# EasyEDA schematic SCH_RUN-Reset.json

## Sheets
1 SW
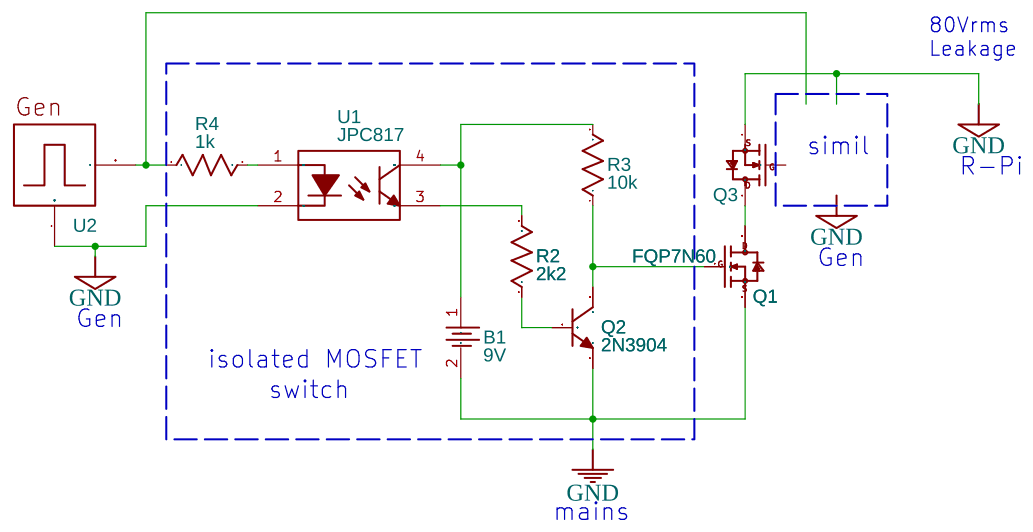
[diagram p0: SW]
2 Diff
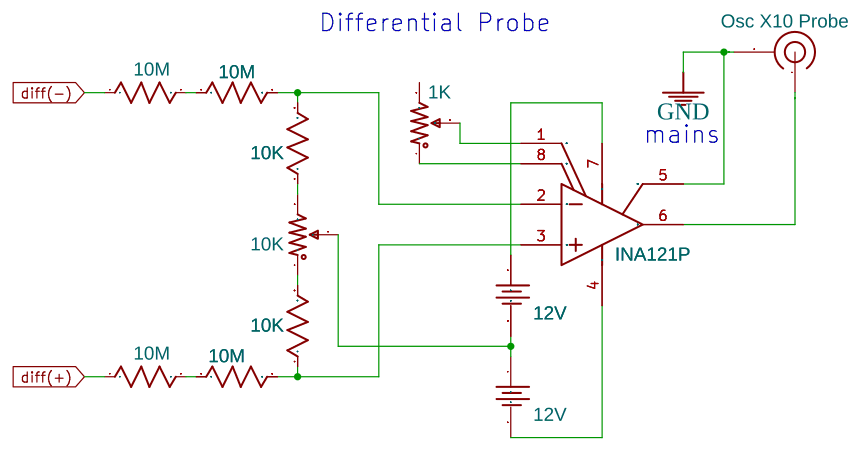
[diagram p1: Diff]
3 Sim
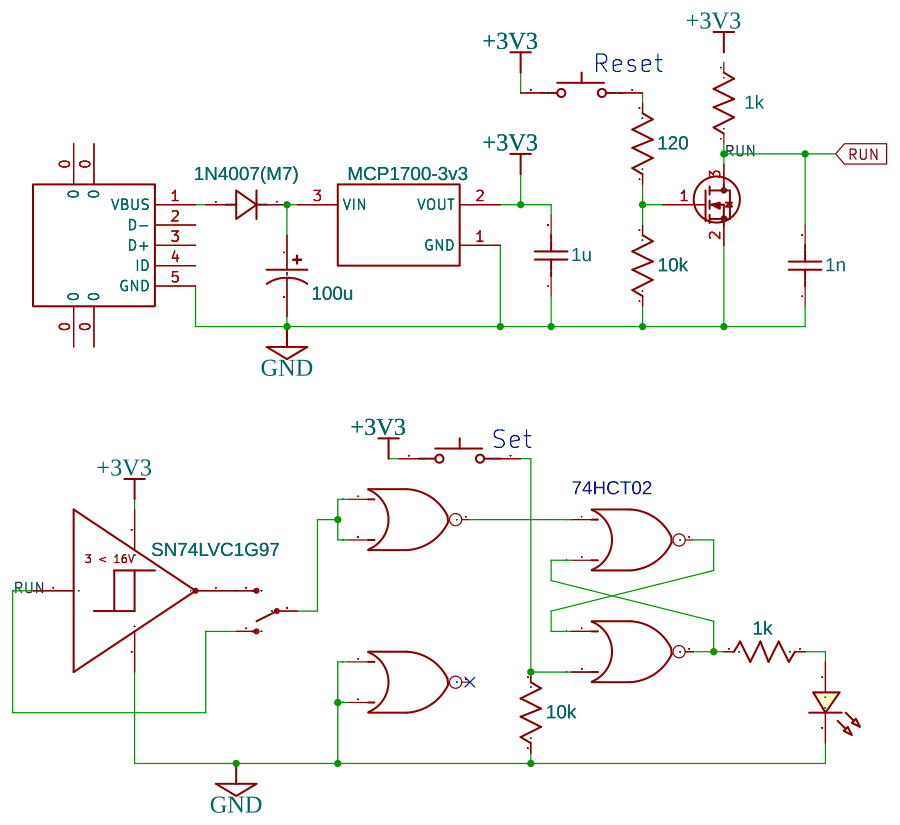
[diagram p2: Sim]
4 Reset
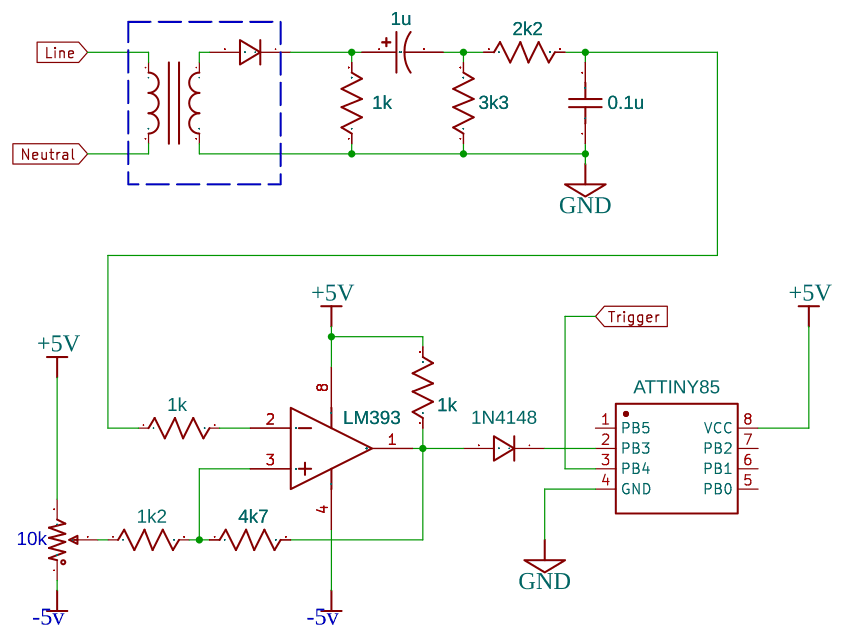
[diagram p3: Reset]

## Parts
sheet Diff
B2  12V  [BAT-SMD_CR1220-2]
B3  12V  [BAT-SMD_CR1220-2]
R1  10M  [R0603]
R5  10M  [R0603]
R6  10M  [R0603]
R7  10M  [R0603]
R8  10K  [R0603]
R9  10K  [R0603]
RP1  1K  [RES-ADJ-TH_3386P]
RP2  10K  [RES-ADJ-TH_3386P]
U3  Osc X10 Probe  [COAX PCB]
U4  INA121P  [PDIP-8_L9.5-W6.4-P2.54-LS7.6-BL]
sheet Reset
C3  1u  [CASE-A_3216]
C4  0.1u  [C0603]
D1  1N4007W  [SOD-123_L2.8-W1.8-LS3.7-RD]
D2  1N4148  [SOD-123_L2.8-W1.8-LS3.7-RD]
R15  1k  [R0603]
R16  3k3  [R0603]
R17  2k2  [R0603]
R18  1k2  [R0603]
R19  4k7  [R0603]
R20  1k  [R0603]
R21  1k  [R0603]
RP3  R_3386P_US  [RES-ADJ-TH_3386P]
U14  TRANS  [TRANSFORMER]
U15  LM393  [SOIC-8_L4.9-W3.9-P1.27-LS6.0-BL]  (section 1)
U16  ATTINY85  [SOIC-8_L5.3-W5.3-P1.27-LS8.0-BL]
sheet Sim
C1  100u  [CASE-A_3216]
C2  1u  [C0603]
C5  1n  [C0603]
LED1  LED-0603_R  [LED0603_RED]
R10  10k  [R0603]
R11  120  [R0603]
R12  1k  [R0603]
R13  1k  [R0603]
R14  10k  [R0603]
S1  SWITCH-SPDT Panelmount  [STDP GABBAGABI]
SN74LVC1G97  NO  [SCHMITT INVERTER]
U5  1N4007(M7)  [SMA_L4.3-W2.7-LS5.1-RD]
U6  MCP1700-3v3  [SOT-23-3_L2.9-W1.3-P1.90-LS2.4-BR]
U7  NO  [2N7002]
U8  BUTTON2  [SW-SMD_L6.0-W3.5-LS8.0-1]
U9  NO
U10  NO
U11  NO
U12  NO
U13  BUTTON2  [SW-SMD_L6.0-W3.5-LS8.0-1]
USB1  micro 5P_C77238  [MICRO-USB_MICRO-USB-17]
sheet SW
B1  9V  [BAT-SMD_CR1220-2]
Q1  FQP7N60  [SEEED-SOT-23]
Q2  2N3904  [TO-92-3_L5.1-W4.1-P1.27-L]
Q3  NO  [SEEED-SOT-23]
R2  2k2  [R0603]
R3  10k  [R0603]
R4  1k  [R0603]
U1  JPC817  [DIP-4_L6.5-W4.6-P2.54-LS7.6-BL]
U2  NO  [FUNCTION GENERATOR KK]

## Library data of the parts
B1-B3 = CR1220-2: Supplier: LCSC; Manufacturer: Q&J; image: //image.lceda.cn/szlcsc/C70381.jpg; Supplier Part: C70381
R1-R21 = R_0603_US: Contributor: LCEDA_Lib
RP1 RP3 = R_3386P_US: Supplier: LCSC; Contributor: LCEDA_Lib; value(Ω): 10K
RP2 = R_3386P_US: Supplier: LCSC; Contributor: LCEDA_Lib
U3 = coax: Contributor: nomouelle
U4 = INA121P: Contributor: LCSC; Supplier: LCSC; Supplier Part: C1347772; Manufacturer: TI(德州仪器); JLCPCB Part Class: Extended Part; link: https://lcsc.com/eda_search?q=C1347772&%26type=1&ref=editor
C1 C3 = C_Tan_SMD_A_US: Contributor: LCEDA_Lib
C2 C4 C5 = C_0603_US: Contributor: LCEDA_Lib
D1 D2 = 1N4007W: Supplier: LCSC; Supplier Part: C328592; Manufacturer: BLUE ROCKET; Contributor: LCEDA_Lib
U14 = TRANS: Contributor: 4ENGINEERS
U15 = LM393A-SR: subpart_no: 1; Supplier: LCSC; Supplier Part: C2690180; Manufacturer: 3PEAK; link: https://lcsc.com/eda_search?q=C2690180&%26type=1&ref=editor
U16 = ATTINY85V-10SU: Contributor: LCSC; Supplier: LCSC; Supplier Part: C152192; Manufacturer: MICROCHIP(美国微芯); JLCPCB Part Class: Extended Part; link: https://lcsc.com/eda_search?q=C152192&%26type=1&ref=editor
LED1 = LED-0603_R: Manufacturer: EVERLIGHT(台湾亿光); Manufacturer Part: 19-217/R6C-AL1M2VY/3T; Supplier Part: C72044; Supplier: LCSC; Contributor: LCEDA_01
S1 = SWITCH-SPDT Panelmount: Contributor: gabbagabi
SN74LVC1G97 = Schmitt Inverter: Manufacturer: ROHM Semiconductor; Manufacturer Part: BU4S584G2-TR; Supplier: Mouser; link: https://www.mouser.tw/ProductDetail/ROHM-Semiconductor/BU4S584G2-TR?qs=%2Fha2pyFadujrli%252BPTslmoLvNkPYOHJBJfyhxRCxfzx0KWZPwSXGCuA%3D%3D; Contributor: hunglaa; Rated Power: 0.67; Rated Voltage: 16
U5 = 1N4007(M7): Contributor: lcsc; Supplier: LCSC; Supplier Part: C2988638; Manufacturer: UMW(广东友台半导体); JLCPCB Part Class: Extended Part; link: https://lcsc.com/eda_search?q=C2988638&%26type=1&ref=editor
U6 = MCP1700T-3002E/TT: Supplier: LCSC; Manufacturer: MICROCHIP(美国微芯); Supplier Part: C62244; JLCPCB Part Class: Extended Part; link: https://lcsc.com/eda_search?q=C62244&%26type=1&ref=editor
U7 = 2N7002-: Contributor: DrSavitaGaur; Supplier: SeeedStudio
U8 U13 = BUTTON2: Contributor: LCSC; Supplier: LCSC; Supplier Part: C9900005988; Manufacturer: null; JLCPCB Part Class: Extended Part; link: https://lcsc.com/eda_search?q=C9900005988&%26type=1&ref=editor
U9-U12 = NorGate
USB1 = micro 5P_C77238: Contributor: 立创EDA官方封装库; Supplier: LCSC; Supplier Part: C77238; Manufacturer: 精拓金; Manufacturer Part: 920-D62A2021S10107; JLCPCB Part Class: Extended Part; link: https://lcsc.com/eda_search?q=C77238&%26type=1&ref=editor
Q1 Q3 = MOSFET-N: sourceId: lTtPN9uQc
Q2 = 2N3904: Supplier: LCSC; Manufacturer: ST(先科); Supplier Part: C118538; JLCPCB Part Class: Extended Part; link: https://lcsc.com/eda_search?q=C118538&%26type=1&ref=editor
U1 = JPC817: Contributor: lcsc; Supplier: LCSC; Supplier Part: C5365399; Manufacturer: JUXING(钜兴); link: https://lcsc.com/eda_search?q=C5365399&%26type=1&ref=editor
U2 = Function generator copy: Contributor: Schwamela

## Nets
+3V3: C2.2 SN74LVC1G97.5 U6.2(VOUT) U8.1 U13.1
+5V: R21.2 RP3.3 U15.8(V+) U16.8(VCC)
-5v: RP3.1 U15.4(V-)
GND: B1.2 C1.2 C2.1 C4.1 C5.1 LED1.2 Q1.2(S) Q2.1(E) Q3.2(S) R10.1 R14.1 R15.1 R16.1 SN74LVC1G97.3 U1.2(Cathode) U2.1(Ground) U4.5(Ref) U6.1(GND) U7.2(S) U10.1 U10.2 U14.3 U16.4(GND) USB1.5(GND)
diff(+): R7.1
diff(-): R6.1
Line: U14.1
Neutral: U14.2
RUN: C5.2 R12.1 S1.2(O) SN74LVC1G97.2 U7.3(D)
Trigger: U16.3(PB4)
Net-(B1-1): B1.1 R3.2 U1.4(Collector)
Net-(B2-1): B2.1 U4.7(V+)
Net-(B2-2): B2.2 B3.1 RP2.2
Net-(B3-2): B3.2 U4.4(V-)
Net-(C1-1): C1.1 U5.1(K) U6.3(VIN)
Net-(C3-1): C3.1 D1.1 R15.2
Net-(C3-2): C3.2 R16.2 R17.1
Net-(C4-2): C4.2 R17.2 R20.1
Net-(D1-2): D1.2 U14.4
Net-(D2-1): D2.1 U16.2(PB3)
Net-(D2-2): D2.2 R19.2 R21.1 U15.1(Out A)
Net-(LED1-1): LED1.1 R13.2
Net-(Q1-1): Q1.1(G) Q2.3(C) R3.1
Net-(Q1-3): Q1.3(D) Q3.3(D)
Net-(Q2-2): Q2.2(B) R2.1
Net-(R1-1): R1.1 R6.2
Net-(R1-2): R1.2 R8.2 U4.2(V– IN)
Net-(R2-2): R2.2 U1.3(Emitter)
Net-(R4-1): R4.1 U2..(2)
Net-(R4-2): R4.2 U1.1(Anode)
Net-(R5-1): R5.1 R7.2
Net-(R5-2): R5.2 R9.1 U4.3(V+ IN)
Net-(R8-1): R8.1 RP2.3
Net-(R9-2): R9.2 RP2.1
Net-(R10-2): R10.2 R11.1 U7.1(G)
Net-(R11-2): R11.2 U8.2
Net-(R13-1): R13.1 U11.2 U12.3
Net-(R14-2): R14.2 U12.2 U13.2
Net-(R18-1): R18.1 RP3.2
Net-(R18-2): R18.2 R19.1 U15.3(+In A)
Net-(R20-2): R20.2 U15.2(-In A)
Net-(RP1-1): RP1.1 U4.8(RG)
Net-(RP1-2): RP1.2 U4.1(RG)
Net-(S1-1): S1.1(P) U9.1 U9.2
Net-(S1-3): S1.3(S) SN74LVC1G97.4
Net-(U5-2): U5.2(A) USB1.1(VBUS)
Net-(U9-3): U9.3 U11.1
Net-(U11-3): U11.3 U12.1

Not connected (* = marked no-connect by the designer): Q3 1(G); R12 2; RP1 3; U3 3(GND) 4(SIGNAL); U4 6(VO); U10 3*; U16 1(PB5) 5(PB0) 6(PB1) 7(PB2); USB1 0 2(D-) 3(D+) 4(ID)

## Notes on the sheets
sheet 1
- 80Vrms
  Leakage
- simil
- R-Pi
- Gen
- Gen
- isolated MOSFET
- switch
- mains
sheet 2
- Differential Probe
- mains
sheet 3
- Reset
- Set
- 74HCT02
sheet 4
- 10k
